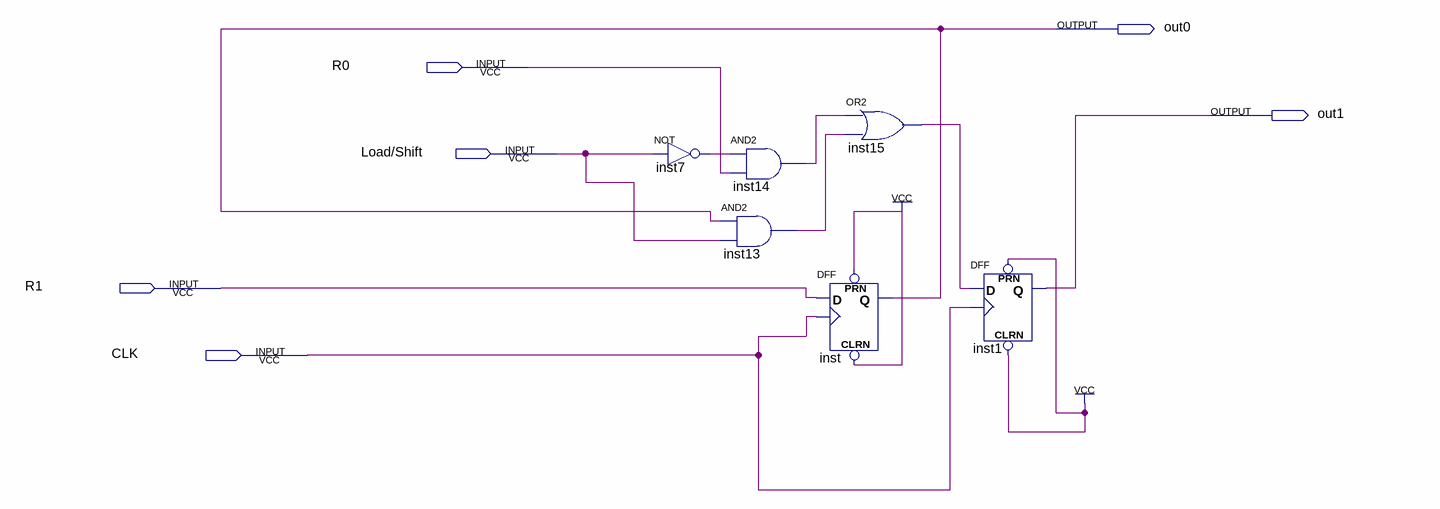
[diagram p0: schematic sheet]
// Quartus schematic shiftRegister.bdf as structural Verilog: 6 symbols, 6 pins
module shiftRegister (
  input  R0,
  input  \Load/Shift ,
  input  R1,
  input  CLK,
  output out0,
  output out1
);

  wire inst7_out, inst13_out, inst14_out, inst15_out;

  not inst7 (inst7_out, \Load/Shift );
  and inst14 (inst14_out, inst7_out, R0);
  and inst13 (inst13_out, out0, \Load/Shift );
  or inst15 (inst15_out, inst14_out, inst13_out);
  DFF inst (.CLRN(1'b1), .CLK(CLK), .D(R1), .PRN(1'b1), .Q(out0));
  DFF inst1 (.CLRN(1'b1), .CLK(CLK), .D(inst15_out), .PRN(1'b1), .Q(out1));
endmodule
